# EAGLE design FreedomWing (EAGLE 9.5.2)
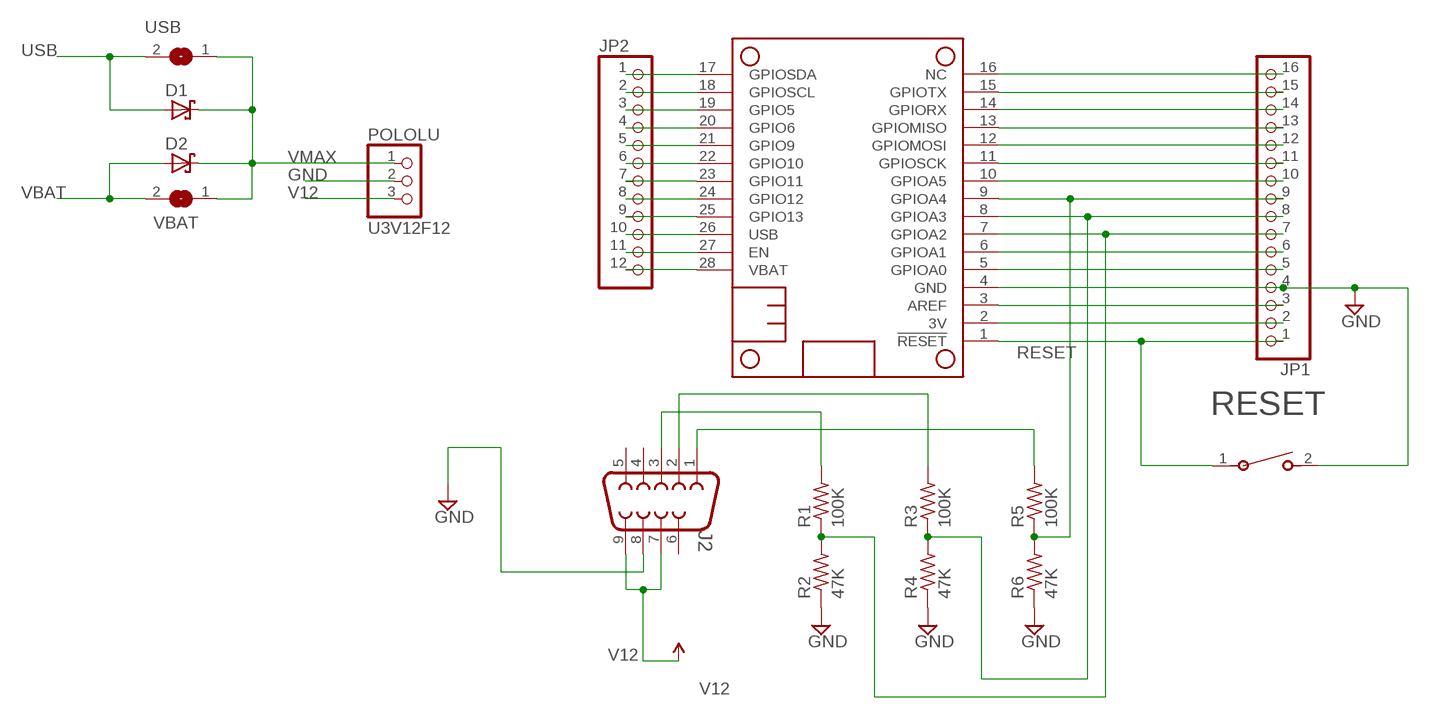
[diagram p0: schematic, sheet 1]

## Parts
D1  SCHOTTKY-DIODEDO41-7  [DO41-7]
D2  SCHOTTKY-DIODEDO41-7  [DO41-7]
J2  DB9MALE  [DB9_MALE]
JP1  PINHD-1X16  [1X16]
JP2  PINHD-1X12  [1X12]
MS1  FEATHERWING_NODIM  [FEATHERWING_DIM]
POLOLU  U3V12F12  PINHD-1X3  [1X03]
R1  100K  R-US_0207/10  [0207/10]
R2  47K  R-US_0207/10  [0207/10]
R3  100K  R-US_0207/10  [0207/10]
R4  47K  R-US_0207/10  [0207/10]
R5  100K  R-US_0207/10  [0207/10]
R6  47K  R-US_0207/10  [0207/10]
RESET  1825966-1  [SWDIP2_256X170P100]
USB  SJW  [SJW]
VBAT  SJW  [SJW]

## Nets
3V: JP1.2 MS1.2(3V)
GND: J2.8 JP1.4 MS1.4(GND) POLOLU.2 R2.1 R4.1 R6.1 RESET.2
N$1: J2.3 R1.2
N$2: JP2.1 MS1.17(GPIOSDA)
N$3: JP2.2 MS1.18(GPIOSCL)
N$4: JP2.3 MS1.19(GPIO5)
N$5: JP1.7 MS1.7(GPIOA2) R1.1 R2.2
N$6: JP1.8 MS1.8(GPIOA3) R3.1 R4.2
N$7: JP1.9 MS1.9(GPIOA4) R5.1 R6.2
N$9: J2.2 R3.2
N$10: J2.1 R5.2
N$11: JP2.4 MS1.20(GPIO6)
N$12: JP2.5 MS1.21(GPIO9)
N$13: JP2.6 MS1.22(GPIO10)
N$14: JP2.7 MS1.23(GPIO11)
N$15: JP2.8 MS1.24(GPIO12)
N$16: JP2.9 MS1.25(GPIO13)
N$17: JP1.10 MS1.10(GPIOA5)
N$18: JP1.16 MS1.16(NC)
N$19: JP1.15 MS1.15(GPIOTX)
N$20: JP1.14 MS1.14(GPIORX)
N$21: JP1.13 MS1.13(GPIOMISO)
N$22: JP1.12 MS1.12(GPIOMOSI)
N$23: JP1.11 MS1.11(GPIOSCK)
N$24: JP2.11 MS1.27(EN)
N$27: JP1.3 MS1.3(AREF)
N$29: JP1.6 MS1.6(GPIOA1)
N$30: JP1.5 MS1.5(GPIOA0)
RESET: JP1.1 MS1.1(!RESET) RESET.1
USB: D1.A JP2.10 MS1.26(USB) USB.2
V12: J2.7 J2.9 POLOLU.3
VBAT: D2.A JP2.12 MS1.28(VBAT) VBAT.2
VMAX: D1.C D2.C POLOLU.1 USB.1 VBAT.1
Unconnected: J2.4 J2.5 J2.6

## Library data of the parts
D1 D2 = adafruit:SCHOTTKY-DIODE: Schottky Diode
J2 = SparkFun-Connectors:DB9: DB9 Connector Standard DB9 (D-Sub 9) serial connector. Can be used for CAN bus as well as RS485 and RS232. Footprint production proven. Here is the female version connector we sell at SparkFun: 9 Pin Female Serial Connector - PCB Mount <https://www.sparkfun.com/products/429> (PRT-00429) This connector has been used on the following SparkFun products: SparkFun RS232 Shifter - SMD <https://www.sparkfun.com/products/449> (PRT-00449) SparkFun RS232 Shifter SMD (No DB9) <https://www.sparkfun.com/products/8780> (PRT-08780); PROD_ID: CONN-09904
JP1 = pinhead:PINHD-1X16: PIN HEADER
JP2 = pinhead:PINHD-1X12: PIN HEADER
MS1 = adafruit:FEATHERWING
POLOLU = pinhead:PINHD-1X3: PIN HEADER
R1-R6 = adafruit:R-US_: RESISTOR, American symbol
RESET = ATMakers:1825966-1; BUILT_BY: EMA_UL_Team; COPYRIGHT: Copyright (C) 2016 Accelerated Designs. All rights reserved; MANUFACTURER_PART_NUMBER: 1825966-1; VENDOR: TE Connectivity
USB VBAT = jumper:SJ: SMD solder JUMPER

## Board
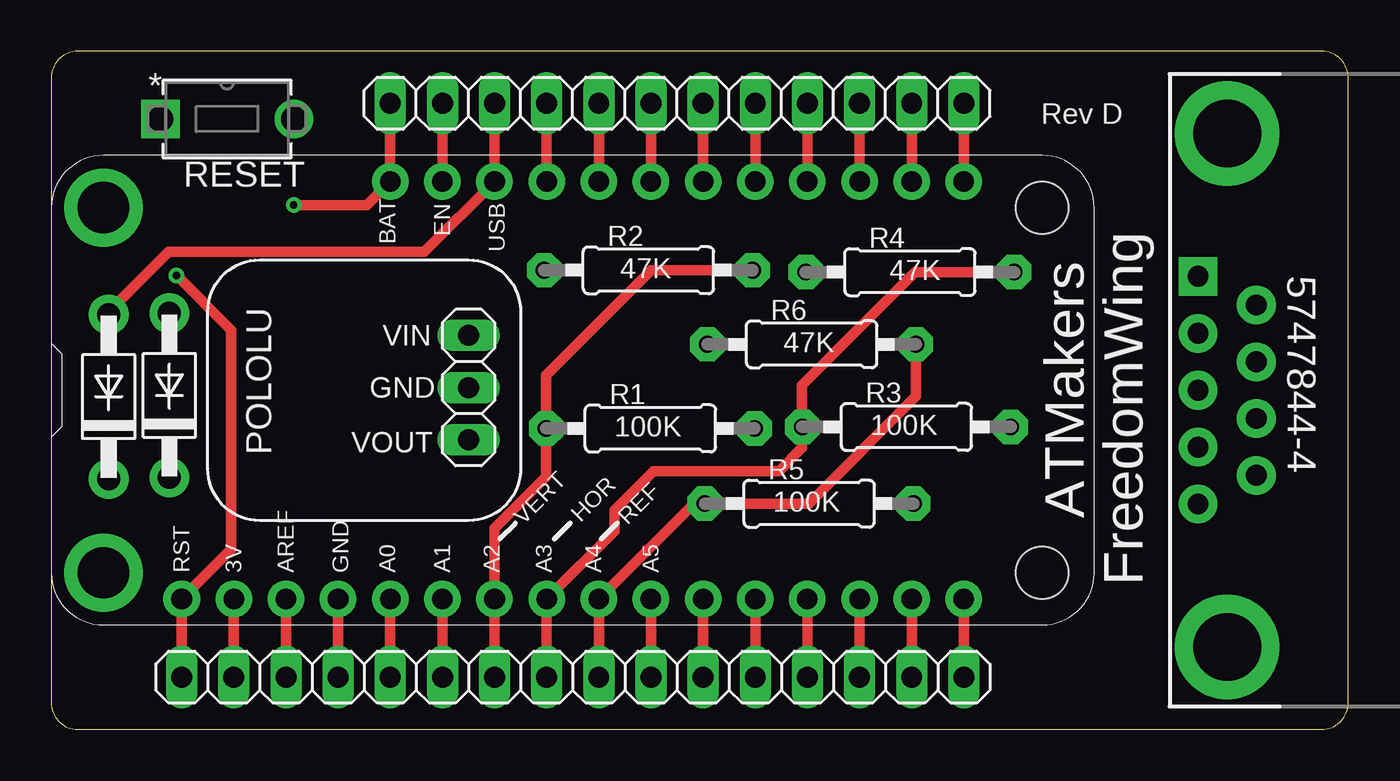
[diagram p1: board, top side]
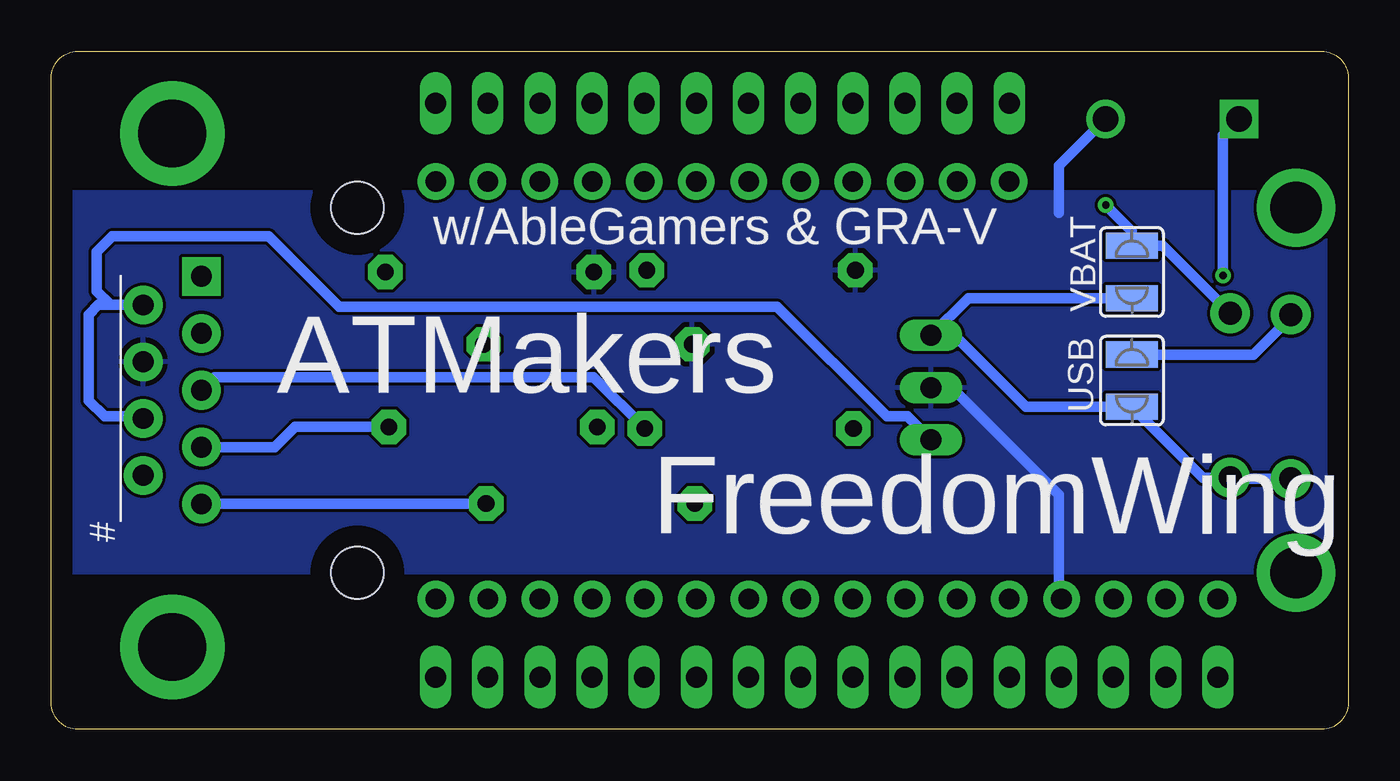
[diagram p2: board, bottom side, seen from below]

Size 63.17 x 33.01 mm. Coordinates in mm from the lower left corner, seen from the top.
Outline: 0,31.74 0,1.27 arc90 1.27,0 61.9,0 arc90 63.17,1.27 63.17,31.74 arc90 61.9,33.01 1.27,33.01 arc90 0,31.74
Copper layers (1*16): Top 0.035mm / dielectric 1.5mm / Bottom 0.035mm
Design rules "default *": minimum track width 6mil, minimum drill 0.35mm, track to track 6mil, track to pad 6mil, pad to pad 6mil, via to via 6mil, smd to smd 6mil, copper to edge 40mil, drill to drill 6mil, minimum pad ring 10mil, minimum via ring 8mil, stop-mask expansion 4mil, vias tented up to drill 20mil, thermal gap 10mil

### Footprints (pad centres in the part's own frame; a part is rotated, then mirrored left to right if it is on the bottom)
DO41-7 = drill 1.118 pad 1.93: A 4,0; C -4,0
DB9_MALE = drill 1.016 pad 1.88: 1 5.54,-1.42; 2 2.77,-1.42; 3 0,-1.42; 4 -2.77,-1.42; 6 4.15,1.42; 7 1.38,1.42; 8 -1.38,1.42; 9 -4.15,1.42 | drill 1.016 pad 1.88 square: 5 -5.54,-1.42 | drill 3.302 pad 5.08: G1 -12.5,0; G2 12.5,0
1X16 = drill 1.016 long: 1 -19.05,0; 2 -16.51,0; 3 -13.97,0; 4 -11.43,0; 5 -8.89,0; 6 -6.35,0; 7 -3.81,0; 8 -1.27,0; 9 1.27,0; 10 3.81,0; 11 6.35,0; 12 8.89,0; 13 11.43,0; 14 13.97,0; 15 16.51,0; 16 19.05,0
1X12 = drill 1.016 long: 1 -13.97,0; 2 -11.43,0; 3 -8.89,0; 4 -6.35,0; 5 -3.81,0; 6 -1.27,0; 7 1.27,0; 8 3.81,0; 9 6.35,0; 10 8.89,0; 11 11.43,0; 12 13.97,0
FEATHERWING_DIM = drill 1 pad 1.778: 1 6.35,1.27; 2 8.89,1.27; 3 11.43,1.27; 4 13.97,1.27; 5 16.51,1.27; 6 19.05,1.27; 7 21.59,1.27; 8 24.13,1.27; 9 26.67,1.27; 10 29.21,1.27; 11 31.75,1.27; 12 34.29,1.27; 13 36.83,1.27; 14 39.37,1.27; 15 41.91,1.27; 16 44.45,1.27; 17 44.45,21.59; 18 41.91,21.59; 19 39.37,21.59; 20 36.83,21.59; 21 34.29,21.59; 22 31.75,21.59; 23 29.21,21.59; 24 26.67,21.59; 25 24.13,21.59; 26 21.59,21.59; 27 19.05,21.59; 28 16.51,21.59 | drill 2.5 pad 3.81: P$1 2.54,20.32; P$2 2.54,2.54 | hole 2.54: 48.26,20.32; 48.26,2.54
1X03 = drill 1.016 long: 1 -2.54,0; 2 0,0; 3 2.54,0
0207/10 = drill 0.813 pad 1.676 octagon: 1 -5.08,0; 2 5.08,0
SWDIP2_256X170P100 = drill 1.245 pad 1.753 square: 1 -6.502,0 | drill 1.245 pad 1.753: 2 0,0
SJW = smd 1.27 x 2.54: 1 -1.27,0; 2 1.27,0

### Placement (x,y rotation side)
D1  2.79,16.19 90 top
D2  5.75,16.26 90 top
J2  57.28,16.51 270 top
JP1  25.4,2.54 0 top
JP2  30.48,30.48 180 top
MS1  0,5.08 0 top
POLOLU  20.32,16.64 270 top
R1  29.18,14.65 0 top
R2  29.08,22.35 0 top
R3  41.65,14.72 0 top
R4  41.82,22.26 0 top
R5  36.91,10.99 0 top
R6  37.03,18.75 0 top
RESET  11.81,29.72 0 top
USB  10.53,16.98 90 bottom
VBAT  10.53,22.27 90 bottom

### Tracks (layer width: path | path; a pad name or v marks a point on that pad's centre or on a via)
3V
  Top 0.508: MS1.2 JP1.2
GND
  Top 0.508: JP1.4 MS1.4
  Bottom 0.508: POLOLU.2 19.3,16.64 14.1,11.43 14.1,6.48 MS1.4 | RESET.2 14.1,27.43 14.1,25.15
  pour Bottom: 0,26.16 62.23,26.16 62.23,7.62 0,7.62
N$1
  Bottom 0.508: R1.2 36.76,17.14 55.22,17.14 J2.3
N$2
  Top 0.508: MS1.17 JP2.1
N$3
  Top 0.508: JP2.2 MS1.18
N$4
  Top 0.508: MS1.19 JP2.3
N$5
  Top 0.508: JP1.7 MS1.7 21.59,9.78 24.1,12.29 R1.1 24.1,17.25 29.21,22.35 R2.2
N$6
  Top 0.508: JP1.8 MS1.8 27.43,9.65 27.43,10.67 29.34,12.57 35.43,12.57 36.57,13.71 R3.1 36.57,16.76 42.08,22.26 R4.2
N$7
  Top 0.508: JP1.9 MS1.9 31.31,10.99 R5.1 36.89,10.99 42.11,16.21 R6.2
N$9
  Bottom 0.508: R3.2 51.3,14.72 52.28,13.74 J2.2
N$10
  Bottom 0.508: J2.1 55.84,10.99 R5.2
N$11
  Top 0.508: JP2.4 MS1.20
N$12
  Top 0.508: MS1.21 JP2.5
N$13
  Top 0.508: JP2.6 MS1.22
N$14
  Top 0.508: MS1.23 JP2.7
N$15
  Top 0.508: JP2.8 MS1.24
N$16
  Top 0.508: MS1.25 JP2.9
N$17
  Top 0.508: JP1.10 MS1.10
N$18
  Top 0.508: MS1.16 JP1.16
N$19
  Top 0.508: MS1.15 JP1.15
N$20
  Top 0.508: MS1.14 JP1.14
N$21
  Top 0.508: MS1.13 JP1.13
N$22
  Top 0.508: MS1.12 JP1.12
N$23
  Top 0.508: MS1.11 JP1.11
N$24
  Top 0.508: MS1.27 JP2.11
N$27
  Top 0.508: JP1.3 MS1.3
N$29
  Top 0.508: MS1.6 JP1.6
N$30
  Top 0.508: MS1.5 JP1.5
RESET  (via drill 0.35)
  Top 0.508: JP1.1 MS1.1 8.76,8.76 8.76,19.43 v6.1,22.1
  Bottom 0.508: v6.1,22.1 6.1,28.93 RESET.1
USB
  Top 0.508: JP2.10 MS1.26 18.16,23.24 5.71,23.24 2.79,20.32 D1.A
  Bottom 0.508: USB.2 4.61,18.25 2.79,20.07 D1.A
V12
  Bottom 0.508: POLOLU.3 21.46,15.24 22.48,15.24 27.81,20.57 49.15,20.57 52.58,24 60.2,24 60.96,23.24 60.96,21.34 60.28,20.66 | J2.7 58.81,15.24 60.58,15.24 61.34,16 61.34,20.19 60.87,20.66 60.28,20.66 | J2.9 59.44,20.66 60.28,20.66
VBAT  (via drill 0.35)
  Top 0.508: JP2.12 MS1.28 15.37,25.53 v11.81,25.53
  Bottom 0.508: v11.81,25.53 10.53,24.25 VBAT.2 9.02,23.54 D2.A
VMAX
  Bottom 0.508: D1.C 6.09,12.19 6.1,12.19 5.81,12.19 D2.C 7.08,12.26 USB.1 15.71,15.71 19.18,19.18 POLOLU.1 18.5,21 VBAT.1

### Text on the board
tPlace: Rev D | BAT | EN | USB | 5747844-4 | VIN | GND | FreedomWing | VOUT | VERT | HOR | REF | ATMakers | RST | 3V | AREF | GND | A0 | A1 | A2 | A3 | A4 | A5
bPlace: #____________ | ATMakers | FreedomWing
bNames: w/AbleGamers & GRA-V